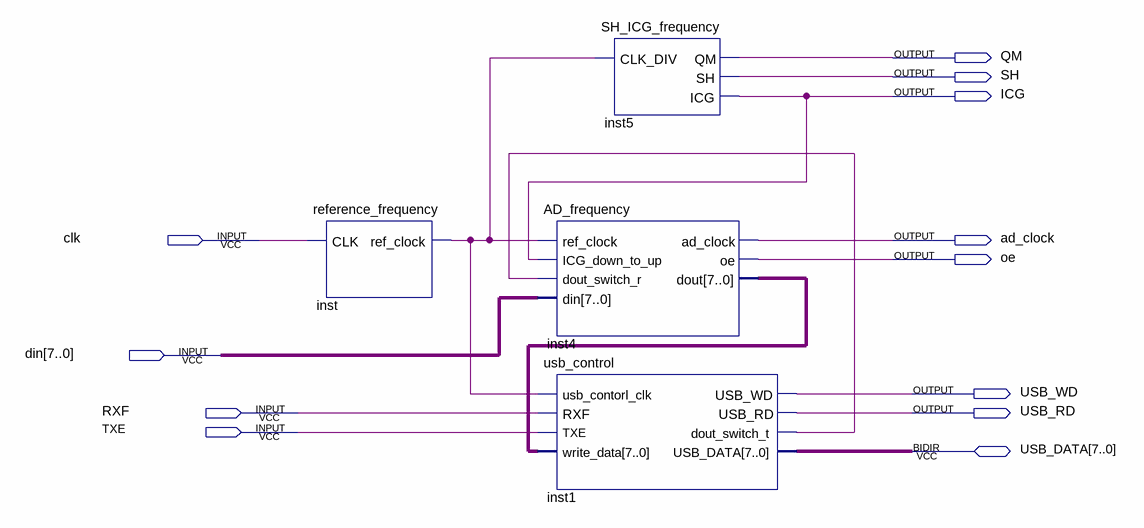
[diagram p0: schematic sheet]
// Quartus schematic industrial_camera_CCD.bdf as structural Verilog: 4 symbols, 12 pins
module industrial_camera_CCD (
  input  clk,
  input  [7:0] din,
  input  RXF,
  input  TXE,
  inout  [7:0] USB_DATA,
  output QM,
  output SH,
  output ICG,
  output ad_clock,
  output oe,
  output USB_WD,
  output USB_RD
);

  wire inst1_dout_switch_t, inst_ref_clock;
  wire [7:0] inst4_dout;

  reference_frequency inst (.CLK(clk), .ref_clock(inst_ref_clock));
  SH_ICG_frequency inst5 (.CLK_DIV(inst_ref_clock), .QM(QM), .SH(SH), .ICG(ICG));
  AD_frequency inst4 (
    .ref_clock(inst_ref_clock), .ICG_down_to_up(ICG), .dout_switch_r(inst1_dout_switch_t), .din(din),
    .oe(oe), .dout(inst4_dout), .ad_clock(ad_clock));
  usb_control inst1 (
    .usb_contorl_clk(inst_ref_clock), .RXF(RXF), .TXE(TXE), .write_data(inst4_dout), .USB_WD(USB_WD),
    .USB_RD(USB_RD), .dout_switch_t(inst1_dout_switch_t), .USB_DATA(USB_DATA));
endmodule
